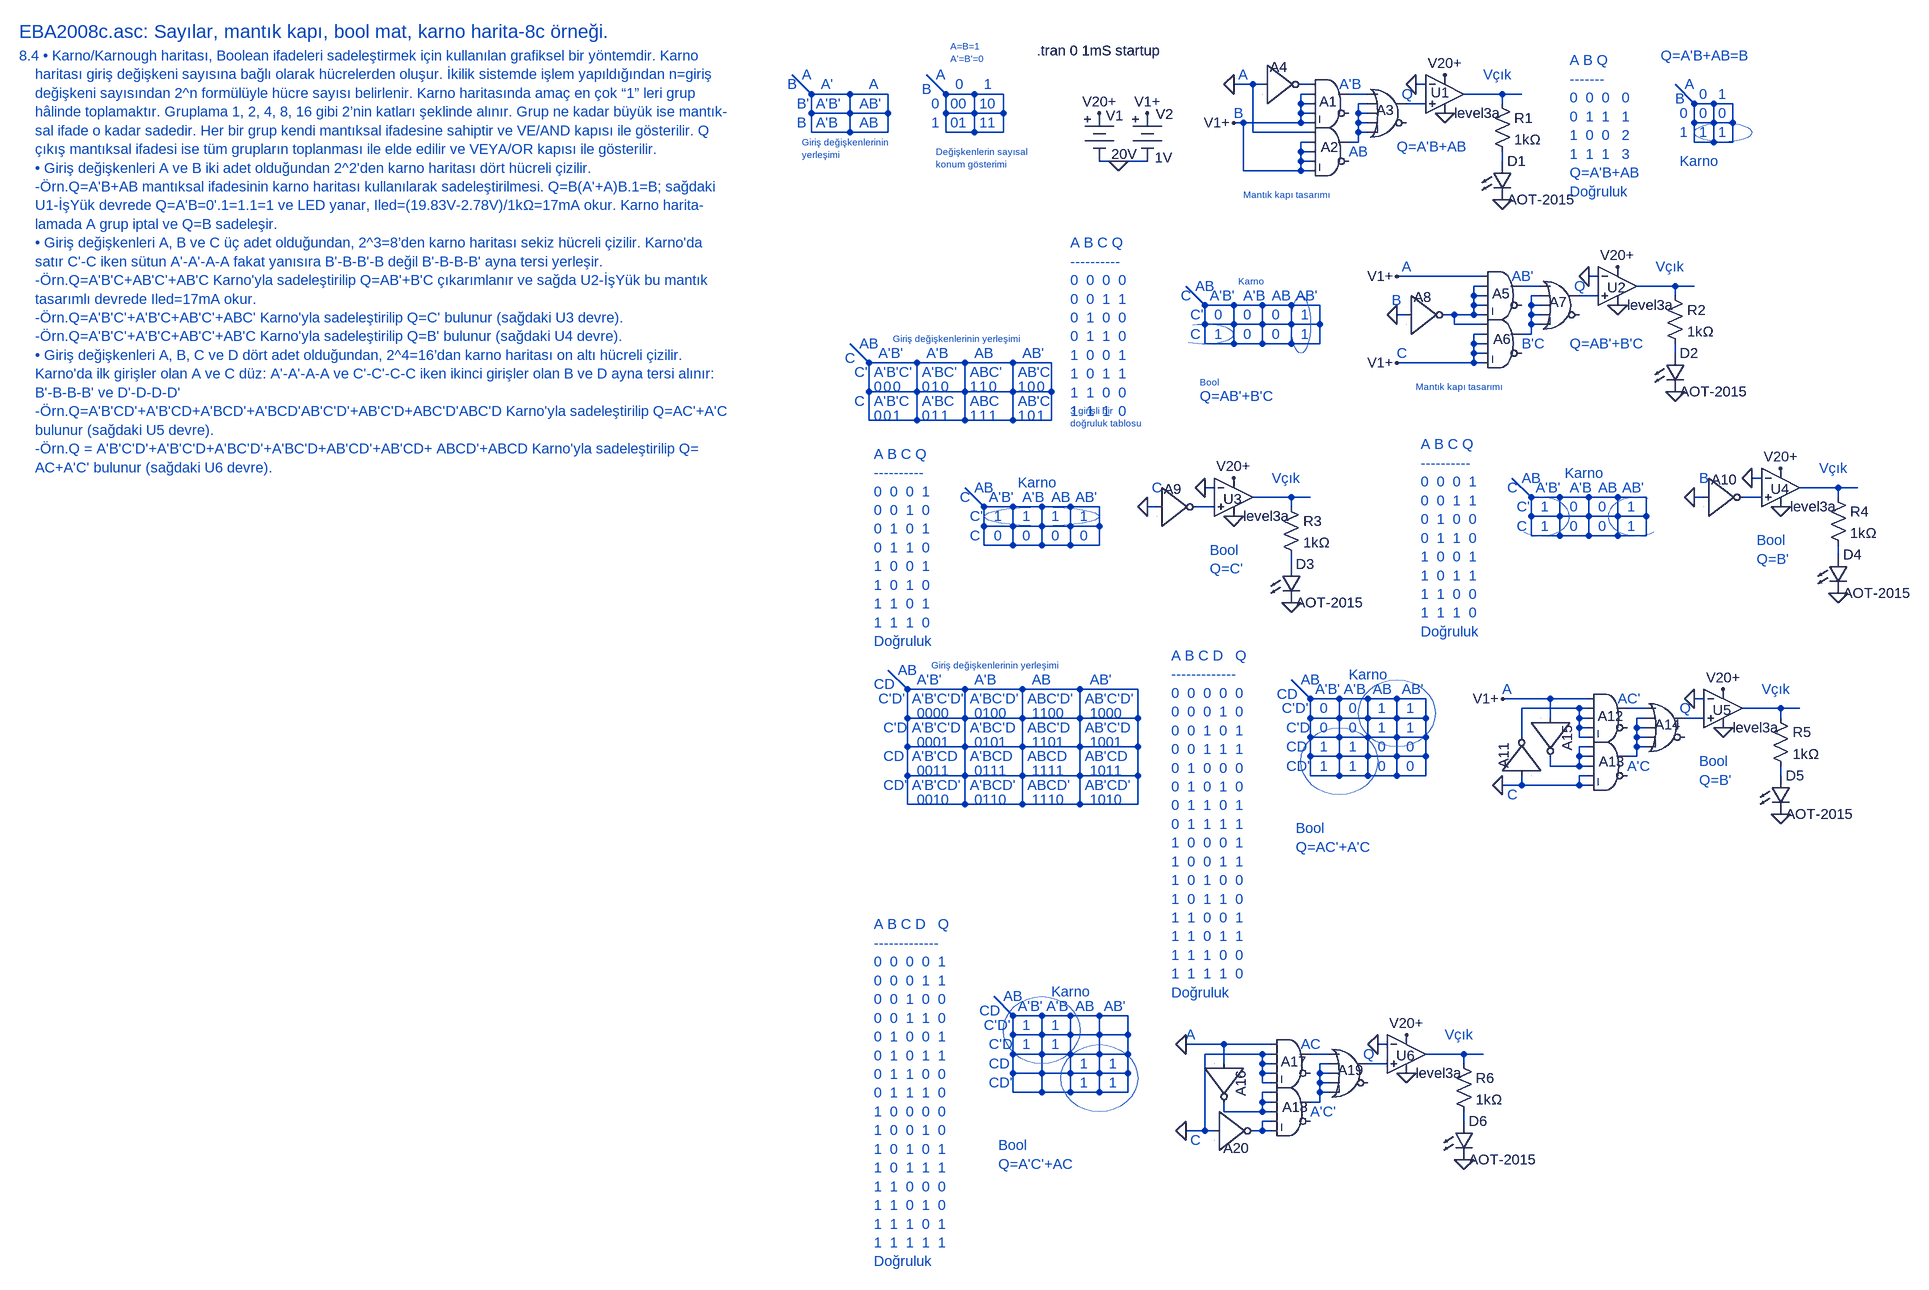
[diagram p0: schematic EBA2008c.asc]
EBA2008c.asc, the LTspice schematic file:
Version 4
SHEET 1 7064 4332
WIRE 1968 144 1936 144
WIRE 1984 144 1968 144
WIRE 2064 144 2048 144
WIRE 2256 144 2240 144
WIRE 1232 160 1200 128
WIRE 1296 160 1232 160
WIRE 1360 160 1296 160
WIRE 1456 160 1424 128
WIRE 1504 160 1456 160
WIRE 1552 160 1504 160
WIRE 2064 160 2048 160
WIRE 2160 160 2128 160
WIRE 2384 160 2320 160
WIRE 2416 160 2384 160
WIRE 2048 176 2048 160
WIRE 2064 176 2048 176
WIRE 2160 176 2144 176
WIRE 2256 176 2224 176
WIRE 2384 176 2384 160
WIRE 2704 176 2672 144
WIRE 2736 176 2704 176
WIRE 2768 176 2736 176
WIRE 1232 192 1232 160
WIRE 1296 192 1296 160
WIRE 1296 192 1232 192
WIRE 1360 192 1360 160
WIRE 1360 192 1296 192
WIRE 1456 192 1456 160
WIRE 1504 192 1504 160
WIRE 1504 192 1456 192
WIRE 1552 192 1552 160
WIRE 1552 192 1504 192
WIRE 2048 192 2048 176
WIRE 2064 192 2048 192
WIRE 2144 192 2144 176
WIRE 2160 192 2144 192
WIRE 1952 208 1936 208
WIRE 2048 208 2048 192
WIRE 2048 208 1952 208
WIRE 2064 208 2048 208
WIRE 2144 208 2144 192
WIRE 2160 208 2144 208
WIRE 2704 208 2704 176
WIRE 2736 208 2736 176
WIRE 2736 208 2704 208
WIRE 2768 208 2768 176
WIRE 2768 208 2736 208
WIRE 1232 224 1232 192
WIRE 1296 224 1296 192
WIRE 1296 224 1232 224
WIRE 1360 224 1360 192
WIRE 1360 224 1296 224
WIRE 1456 224 1456 192
WIRE 1504 224 1504 192
WIRE 1504 224 1456 224
WIRE 1552 224 1552 192
WIRE 1552 224 1504 224
WIRE 1968 224 1968 144
WIRE 2064 224 1968 224
WIRE 2144 224 2144 208
WIRE 2160 224 2144 224
WIRE 2064 240 2048 240
WIRE 2144 240 2144 224
WIRE 2144 240 2128 240
WIRE 2704 240 2704 208
WIRE 2736 240 2736 208
WIRE 2736 240 2704 240
WIRE 2768 240 2768 208
WIRE 2768 240 2736 240
WIRE 2048 256 2048 240
WIRE 2064 256 2048 256
WIRE 1744 272 1712 272
WIRE 1792 272 1744 272
WIRE 2048 272 2048 256
WIRE 2064 272 2048 272
WIRE 2384 272 2384 256
WIRE 1952 288 1952 208
WIRE 2048 288 2048 272
WIRE 2048 288 1952 288
WIRE 2064 288 2048 288
WIRE 2352 464 2208 464
WIRE 2544 464 2528 464
WIRE 2352 480 2336 480
WIRE 2448 480 2416 480
WIRE 2672 480 2608 480
WIRE 2704 480 2672 480
WIRE 2336 496 2336 480
WIRE 2352 496 2336 496
WIRE 2448 496 2432 496
WIRE 2544 496 2512 496
WIRE 2672 496 2672 480
WIRE 1888 512 1856 480
WIRE 1936 512 1888 512
WIRE 1984 512 1936 512
WIRE 2032 512 1984 512
WIRE 2080 512 2032 512
WIRE 2336 512 2336 496
WIRE 2352 512 2336 512
WIRE 2432 512 2432 496
WIRE 2448 512 2432 512
WIRE 2224 528 2208 528
WIRE 2304 528 2288 528
WIRE 2336 528 2336 512
WIRE 2336 528 2304 528
WIRE 2352 528 2336 528
WIRE 2432 528 2432 512
WIRE 2448 528 2432 528
WIRE 1888 544 1888 512
WIRE 1936 544 1936 512
WIRE 1936 544 1888 544
WIRE 1984 544 1984 512
WIRE 1984 544 1936 544
WIRE 2032 544 2032 512
WIRE 2032 544 1984 544
WIRE 2080 544 2080 512
WIRE 2080 544 2032 544
WIRE 2304 544 2304 528
WIRE 2352 544 2304 544
WIRE 2432 544 2432 528
WIRE 2448 544 2432 544
WIRE 2352 560 2336 560
WIRE 2432 560 2432 544
WIRE 2432 560 2416 560
WIRE 1888 576 1888 544
WIRE 1936 576 1936 544
WIRE 1936 576 1888 576
WIRE 1984 576 1984 544
WIRE 1984 576 1936 576
WIRE 2032 576 2032 544
WIRE 2032 576 1984 576
WIRE 2080 576 2080 544
WIRE 2080 576 2032 576
WIRE 2336 576 2336 560
WIRE 2352 576 2336 576
WIRE 2336 592 2336 576
WIRE 2352 592 2336 592
WIRE 2672 592 2672 576
WIRE 1328 608 1296 576
WIRE 1408 608 1328 608
WIRE 1488 608 1408 608
WIRE 1568 608 1488 608
WIRE 1632 608 1568 608
WIRE 2336 608 2336 592
WIRE 2336 608 2208 608
WIRE 2352 608 2336 608
WIRE 1328 656 1328 608
WIRE 1408 656 1408 608
WIRE 1408 656 1328 656
WIRE 1488 656 1488 608
WIRE 1488 656 1408 656
WIRE 1568 656 1568 608
WIRE 1568 656 1488 656
WIRE 1632 656 1632 608
WIRE 1632 656 1568 656
WIRE 1328 704 1328 656
WIRE 1408 704 1408 656
WIRE 1408 704 1328 704
WIRE 1488 704 1488 656
WIRE 1488 704 1408 704
WIRE 1568 704 1568 656
WIRE 1568 704 1488 704
WIRE 1632 704 1632 656
WIRE 1632 704 1568 704
WIRE 2816 800 2800 800
WIRE 1904 816 1888 816
WIRE 2944 816 2880 816
WIRE 2976 816 2944 816
WIRE 2032 832 1968 832
WIRE 2064 832 2032 832
WIRE 2432 832 2400 800
WIRE 2480 832 2432 832
WIRE 2528 832 2480 832
WIRE 2576 832 2528 832
WIRE 2624 832 2576 832
WIRE 2720 832 2704 832
WIRE 2816 832 2784 832
WIRE 2944 832 2944 816
WIRE 1520 848 1488 816
WIRE 1568 848 1520 848
WIRE 1616 848 1568 848
WIRE 1664 848 1616 848
WIRE 1712 848 1664 848
WIRE 1808 848 1792 848
WIRE 1904 848 1872 848
WIRE 2032 848 2032 832
WIRE 2432 864 2432 832
WIRE 2480 864 2480 832
WIRE 2480 864 2432 864
WIRE 2528 864 2528 832
WIRE 2528 864 2480 864
WIRE 2576 864 2576 832
WIRE 2576 864 2528 864
WIRE 2624 864 2624 832
WIRE 2624 864 2576 864
WIRE 1520 880 1520 848
WIRE 1568 880 1568 848
WIRE 1568 880 1520 880
WIRE 1616 880 1616 848
WIRE 1616 880 1568 880
WIRE 1664 880 1664 848
WIRE 1664 880 1616 880
WIRE 1712 880 1712 848
WIRE 1712 880 1664 880
WIRE 2432 896 2432 864
WIRE 2480 896 2480 864
WIRE 2480 896 2432 896
WIRE 2528 896 2528 864
WIRE 2528 896 2480 896
WIRE 2576 896 2576 864
WIRE 2576 896 2528 896
WIRE 2624 896 2624 864
WIRE 2624 896 2576 896
WIRE 1520 912 1520 880
WIRE 1568 912 1568 880
WIRE 1568 912 1520 912
WIRE 1616 912 1616 880
WIRE 1616 912 1568 912
WIRE 1664 912 1664 880
WIRE 1664 912 1616 912
WIRE 1712 912 1712 880
WIRE 1712 912 1664 912
WIRE 2944 928 2944 912
WIRE 2032 944 2032 928
WIRE 1392 1152 1360 1120
WIRE 1488 1152 1392 1152
WIRE 1584 1152 1488 1152
WIRE 1680 1152 1584 1152
WIRE 1776 1152 1680 1152
WIRE 2064 1168 2032 1136
WIRE 2112 1168 2064 1168
WIRE 2160 1168 2112 1168
WIRE 2208 1168 2160 1168
WIRE 2256 1168 2208 1168
WIRE 2464 1168 2384 1168
WIRE 2528 1168 2464 1168
WIRE 2720 1168 2704 1168
WIRE 2512 1184 2416 1184
WIRE 2528 1184 2512 1184
WIRE 2624 1184 2592 1184
WIRE 2848 1184 2784 1184
WIRE 2880 1184 2848 1184
WIRE 1392 1200 1392 1152
WIRE 1488 1200 1488 1152
WIRE 1488 1200 1392 1200
WIRE 1584 1200 1584 1152
WIRE 1584 1200 1488 1200
WIRE 1680 1200 1680 1152
WIRE 1680 1200 1584 1200
WIRE 1776 1200 1776 1152
WIRE 1776 1200 1680 1200
WIRE 2064 1200 2064 1168
WIRE 2112 1200 2112 1168
WIRE 2112 1200 2064 1200
WIRE 2160 1200 2160 1168
WIRE 2160 1200 2112 1200
WIRE 2208 1200 2208 1168
WIRE 2208 1200 2160 1200
WIRE 2256 1200 2256 1168
WIRE 2256 1200 2208 1200
WIRE 2464 1200 2464 1168
WIRE 2512 1200 2512 1184
WIRE 2528 1200 2512 1200
WIRE 2624 1200 2608 1200
WIRE 2720 1200 2688 1200
WIRE 2848 1200 2848 1184
WIRE 2512 1216 2512 1200
WIRE 2528 1216 2512 1216
WIRE 2608 1216 2608 1200
WIRE 2624 1216 2608 1216
WIRE 2064 1232 2064 1200
WIRE 2112 1232 2112 1200
WIRE 2112 1232 2064 1232
WIRE 2160 1232 2160 1200
WIRE 2160 1232 2112 1232
WIRE 2208 1232 2208 1200
WIRE 2208 1232 2160 1232
WIRE 2256 1232 2256 1200
WIRE 2256 1232 2208 1232
WIRE 2416 1232 2416 1184
WIRE 2512 1232 2512 1216
WIRE 2528 1232 2512 1232
WIRE 2608 1232 2608 1216
WIRE 2624 1232 2608 1232
WIRE 1392 1248 1392 1200
WIRE 1488 1248 1488 1200
WIRE 1488 1248 1392 1248
WIRE 1584 1248 1584 1200
WIRE 1584 1248 1488 1248
WIRE 1680 1248 1680 1200
WIRE 1680 1248 1584 1248
WIRE 1776 1248 1776 1200
WIRE 1776 1248 1680 1248
WIRE 2528 1248 2512 1248
WIRE 2608 1248 2608 1232
WIRE 2624 1248 2608 1248
WIRE 2064 1264 2064 1232
WIRE 2112 1264 2112 1232
WIRE 2112 1264 2064 1264
WIRE 2160 1264 2160 1232
WIRE 2160 1264 2112 1264
WIRE 2208 1264 2208 1232
WIRE 2208 1264 2160 1264
WIRE 2256 1264 2256 1232
WIRE 2256 1264 2208 1264
WIRE 2512 1264 2512 1248
WIRE 2528 1264 2512 1264
WIRE 2608 1264 2608 1248
WIRE 2608 1264 2592 1264
WIRE 2464 1280 2464 1264
WIRE 2512 1280 2512 1264
WIRE 2512 1280 2464 1280
WIRE 2528 1280 2512 1280
WIRE 1392 1296 1392 1248
WIRE 1488 1296 1488 1248
WIRE 1488 1296 1392 1296
WIRE 1584 1296 1584 1248
WIRE 1584 1296 1488 1296
WIRE 1680 1296 1680 1248
WIRE 1680 1296 1584 1296
WIRE 1776 1296 1776 1248
WIRE 1776 1296 1680 1296
WIRE 2064 1296 2064 1264
WIRE 2112 1296 2112 1264
WIRE 2112 1296 2064 1296
WIRE 2160 1296 2160 1264
WIRE 2160 1296 2112 1296
WIRE 2208 1296 2208 1264
WIRE 2208 1296 2160 1296
WIRE 2256 1296 2256 1264
WIRE 2256 1296 2208 1296
WIRE 2528 1296 2512 1296
WIRE 2848 1296 2848 1280
WIRE 2416 1312 2416 1296
WIRE 2416 1312 2384 1312
WIRE 2512 1312 2512 1296
WIRE 2512 1312 2416 1312
WIRE 2528 1312 2512 1312
WIRE 1392 1344 1392 1296
WIRE 1488 1344 1488 1296
WIRE 1488 1344 1392 1344
WIRE 1584 1344 1584 1296
WIRE 1584 1344 1488 1344
WIRE 1680 1344 1680 1296
WIRE 1680 1344 1584 1344
WIRE 1776 1344 1776 1296
WIRE 1776 1344 1680 1344
WIRE 1568 1696 1536 1664
WIRE 1616 1696 1568 1696
WIRE 1664 1696 1616 1696
WIRE 1712 1696 1664 1696
WIRE 1760 1696 1712 1696
WIRE 1568 1728 1568 1696
WIRE 1616 1728 1616 1696
WIRE 1616 1728 1568 1728
WIRE 1664 1728 1664 1696
WIRE 1664 1728 1616 1728
WIRE 1712 1728 1712 1696
WIRE 1712 1728 1664 1728
WIRE 1760 1728 1760 1696
WIRE 1760 1728 1712 1728
WIRE 1920 1744 1856 1744
WIRE 2000 1744 1920 1744
WIRE 2192 1744 2176 1744
WIRE 1568 1760 1568 1728
WIRE 1616 1760 1616 1728
WIRE 1616 1760 1568 1760
WIRE 1664 1760 1664 1728
WIRE 1664 1760 1616 1760
WIRE 1712 1760 1712 1728
WIRE 1712 1760 1664 1760
WIRE 1760 1760 1760 1728
WIRE 1760 1760 1712 1760
WIRE 1984 1760 1888 1760
WIRE 2000 1760 1984 1760
WIRE 2096 1760 2064 1760
WIRE 2320 1760 2256 1760
WIRE 2352 1760 2320 1760
WIRE 1920 1776 1920 1744
WIRE 1984 1776 1984 1760
WIRE 2000 1776 1984 1776
WIRE 2096 1776 2080 1776
WIRE 2192 1776 2160 1776
WIRE 2320 1776 2320 1760
WIRE 1568 1792 1568 1760
WIRE 1616 1792 1616 1760
WIRE 1616 1792 1568 1792
WIRE 1664 1792 1664 1760
WIRE 1664 1792 1616 1792
WIRE 1712 1792 1712 1760
WIRE 1712 1792 1664 1792
WIRE 1760 1792 1760 1760
WIRE 1760 1792 1712 1792
WIRE 1984 1792 1984 1776
WIRE 2000 1792 1984 1792
WIRE 2080 1792 2080 1776
WIRE 2096 1792 2080 1792
WIRE 1984 1808 1984 1792
WIRE 2000 1808 1984 1808
WIRE 2080 1808 2080 1792
WIRE 2096 1808 2080 1808
WIRE 1568 1824 1568 1792
WIRE 1616 1824 1616 1792
WIRE 1616 1824 1568 1824
WIRE 1664 1824 1664 1792
WIRE 1664 1824 1616 1824
WIRE 1712 1824 1712 1792
WIRE 1712 1824 1664 1824
WIRE 1760 1824 1760 1792
WIRE 1760 1824 1712 1824
WIRE 2000 1824 1984 1824
WIRE 2080 1824 2080 1808
WIRE 2096 1824 2080 1824
WIRE 1984 1840 1984 1824
WIRE 2000 1840 1984 1840
WIRE 2080 1840 2080 1824
WIRE 2080 1840 2064 1840
WIRE 1920 1856 1920 1840
WIRE 1984 1856 1984 1840
WIRE 1984 1856 1920 1856
WIRE 2000 1856 1984 1856
WIRE 2000 1872 1984 1872
WIRE 2320 1872 2320 1856
WIRE 1888 1888 1888 1760
WIRE 1888 1888 1856 1888
WIRE 1904 1888 1888 1888
WIRE 1984 1888 1984 1872
WIRE 1984 1888 1968 1888
WIRE 2000 1888 1984 1888
FLAG 1936 208 V1+
FLAG 2240 144 0
FLAG 2288 128 V20+
FLAG 2288 192 0
FLAG 1744 272 0
FLAG 1712 192 V20+
FLAG 1792 192 V1+
FLAG 2384 336 0
FLAG 1936 144 0
FLAG 2208 464 V1+
FLAG 2528 464 0
FLAG 2576 448 V20+
FLAG 2576 512 0
FLAG 2672 656 0
FLAG 2208 528 0
FLAG 2208 608 V1+
FLAG 1888 816 0
FLAG 1936 800 V20+
FLAG 1936 864 0
FLAG 2032 1008 0
FLAG 1792 848 0
FLAG 2800 800 0
FLAG 2848 784 V20+
FLAG 2848 848 0
FLAG 2944 992 0
FLAG 2704 832 0
FLAG 2704 1168 0
FLAG 2752 1152 V20+
FLAG 2752 1216 0
FLAG 2848 1360 0
FLAG 2384 1168 V1+
FLAG 2384 1312 0
FLAG 2176 1744 0
FLAG 2224 1728 V20+
FLAG 2224 1792 0
FLAG 2320 1936 0
FLAG 1856 1888 0
FLAG 1856 1744 0
SYMBOL Digital\\and 2096 112 R0
WINDOW 0 -17 61 Left 2
SYMATTR InstName A1
SYMBOL Digital\\and 2096 192 R0
WINDOW 0 -15 57 Left 2
SYMATTR InstName A2
SYMBOL Digital\\or 2192 128 R0
WINDOW 0 -18 59 Left 2
SYMATTR InstName A3
SYMBOL Digital\\inv 1984 80 R0
WINDOW 0 12 35 Left 2
SYMATTR InstName A4
SYMBOL OpAmps\\UniversalOpAmp3 2288 160 R0
WINDOW 0 -23 -2 Left 2
SYMATTR InstName U1
SYMBOL Misc\\battery 1712 176 R0
WINDOW 0 11 20 Left 2
WINDOW 3 20 84 Left 2
SYMATTR InstName V1
SYMATTR Value 20V
SYMBOL Misc\\battery 1792 176 R0
WINDOW 0 14 18 Left 2
WINDOW 3 13 90 Left 2
SYMATTR InstName V2
SYMATTR Value 1V
SYMBOL LED 2368 272 R0
SYMATTR InstName D1
SYMATTR Value AOT-2015
SYMATTR Description Diode
SYMATTR Type diode
SYMBOL res 2368 160 R0
SYMATTR InstName R1
SYMATTR Value 1kΩ
SYMBOL Digital\\and 2384 432 R0
WINDOW 0 -17 61 Left 2
SYMATTR InstName A5
SYMBOL Digital\\and 2384 512 R0
WINDOW 0 -15 57 Left 2
SYMATTR InstName A6
SYMBOL Digital\\or 2480 448 R0
WINDOW 0 -18 59 Left 2
SYMATTR InstName A7
SYMBOL Digital\\inv 2224 464 R0
WINDOW 0 12 35 Left 2
SYMATTR InstName A8
SYMBOL OpAmps\\UniversalOpAmp3 2576 480 R0
WINDOW 0 -17 3 Left 2
SYMATTR InstName U2
SYMBOL LED 2656 592 R0
SYMATTR InstName D2
SYMATTR Value AOT-2015
SYMATTR Description Diode
SYMATTR Type diode
SYMBOL res 2656 480 R0
SYMATTR InstName R2
SYMATTR Value 1kΩ
SYMBOL OpAmps\\UniversalOpAmp3 1936 832 R0
WINDOW 0 -17 3 Left 2
SYMATTR InstName U3
SYMBOL LED 2016 944 R0
SYMATTR InstName D3
SYMATTR Value AOT-2015
SYMATTR Description Diode
SYMATTR Type diode
SYMBOL res 2016 832 R0
SYMATTR InstName R3
SYMATTR Value 1kΩ
SYMBOL Digital\\inv 1808 784 R0
WINDOW 0 12 35 Left 2
SYMATTR InstName A9
SYMBOL OpAmps\\UniversalOpAmp3 2848 816 R0
WINDOW 0 -17 3 Left 2
SYMATTR InstName U4
SYMBOL LED 2928 928 R0
SYMATTR InstName D4
SYMATTR Value AOT-2015
SYMATTR Description Diode
SYMATTR Type diode
SYMBOL res 2928 816 R0
SYMATTR InstName R4
SYMATTR Value 1kΩ
SYMBOL Digital\\inv 2720 768 R0
WINDOW 0 12 35 Left 2
SYMATTR InstName A10
SYMBOL OpAmps\\UniversalOpAmp3 2752 1184 R0
WINDOW 0 -17 3 Left 2
SYMATTR InstName U5
SYMBOL LED 2832 1296 R0
SYMATTR InstName D5
SYMATTR Value AOT-2015
SYMATTR Description Diode
SYMATTR Type diode
SYMBOL res 2832 1184 R0
SYMATTR InstName R5
SYMATTR Value 1kΩ
SYMBOL Digital\\inv 2352 1296 R270
WINDOW 0 12 35 Left 2
SYMATTR InstName A11
SYMBOL Digital\\and 2560 1136 R0
WINDOW 0 -17 61 Left 2
SYMATTR InstName A12
SYMBOL Digital\\and 2560 1216 R0
WINDOW 0 -15 57 Left 2
SYMATTR InstName A13
SYMBOL Digital\\or 2656 1152 R0
WINDOW 0 -18 59 Left 2
SYMATTR InstName A14
SYMBOL Digital\\inv 2528 1200 R90
WINDOW 0 12 35 Left 2
SYMATTR InstName A15
SYMBOL OpAmps\\UniversalOpAmp3 2224 1760 R0
WINDOW 0 -17 3 Left 2
SYMATTR InstName U6
SYMBOL LED 2304 1872 R0
SYMATTR InstName D6
SYMATTR Value AOT-2015
SYMATTR Description Diode
SYMATTR Type diode
SYMBOL res 2304 1760 R0
SYMATTR InstName R6
SYMATTR Value 1kΩ
SYMBOL Digital\\inv 1984 1776 R90
WINDOW 0 12 35 Left 2
SYMATTR InstName A16
SYMBOL Digital\\and 2032 1712 R0
WINDOW 0 -17 61 Left 2
SYMATTR InstName A17
SYMBOL Digital\\and 2032 1792 R0
WINDOW 0 -15 57 Left 2
SYMATTR InstName A18
SYMBOL Digital\\or 2128 1728 R0
WINDOW 0 -18 59 Left 2
SYMATTR InstName A19
SYMBOL Digital\\inv 1904 1824 R0
WINDOW 0 15 93 Left 2
SYMATTR InstName A20
TEXT -232 56 Left 3 ;EBA2008c.asc: Sayılar, mantık kapı, bool mat, karno harita-8c örneği.
TEXT -232 96 Left 2 ;8.4 • Karno/Karnough haritası, Boolean ifadeleri sadeleştirmek için kullanılan grafiksel bir yöntemdir. Karno \n    haritası giriş değişkeni sayısına bağlı olarak hücrelerden oluşur. İkilik sistemde işlem yapıldığından n=giriş \n    değişkeni sayısından 2^n formülüyle hücre sayısı belirlenir. Karno haritasında amaç en çok “1” leri grup\n    hâlinde toplamaktır. Gruplama 1, 2, 4, 8, 16 gibi 2’nin katları şeklinde alınır. Grup ne kadar büyük ise mantık-\n    sal ifade o kadar sadedir. Her bir grup kendi mantıksal ifadesine sahiptir ve VE/AND kapısı ile gösterilir. Q \n    çıkış mantıksal ifadesi ise tüm grupların toplanması ile elde edilir ve VEYA/OR kapısı ile gösterilir.\n    • Giriş değişkenleri A ve B iki adet olduğundan 2^2'den karno haritası dört hücreli çizilir.\n    -Örn.Q=A'B+AB mantıksal ifadesinin karno haritası kullanılarak sadeleştirilmesi. Q=B(A'+A)B.1=B; sağdaki \n    U1-İşYük devrede Q=A'B=0'.1=1.1=1 ve LED yanar, Iled=(19.83V-2.78V)/1kΩ=17mA okur. Karno harita-\n    lamada A grup iptal ve Q=B sadeleşir.\n    • Giriş değişkenleri A, B ve C üç adet olduğundan, 2^3=8’den karno haritası sekiz hücreli çizilir. Karno'da\n    satır C'-C iken sütun A'-A'-A-A fakat yanısıra B'-B-B'-B değil B'-B-B-B' ayna tersi yerleşir.\n    -Örn.Q=A'B'C+AB'C'+AB'C Karno'yla sadeleştirilip Q=AB'+B'C çıkarımlanır ve sağda U2-İşYük bu mantık\n    tasarımlı devrede Iled=17mA okur.\n    -Örn.Q=A'B'C'+A'B'C+AB'C'+ABC' Karno'yla sadeleştirilip Q=C' bulunur (sağdaki U3 devre).\n    -Örn.Q=A'B'C'+A'B'C+AB'C'+AB'C Karno'yla sadeleştirilip Q=B' bulunur (sağdaki U4 devre).\n    • Giriş değişkenleri A, B, C ve D dört adet olduğundan, 2^4=16’dan karno haritası on altı hücreli çizilir.\n    Karno'da ilk girişler olan A ve C düz: A'-A'-A-A ve C'-C'-C-C iken ikinci girişler olan B ve D ayna tersi alınır:\n    B'-B-B-B' ve D'-D-D-D'\n    -Örn.Q=A'B'CD'+A'B'CD+A'BCD'+A'BCD'AB'C'D'+AB'C'D+ABC'D'ABC'D Karno'yla sadeleştirilip Q=AC'+A'C\n    bulunur (sağdaki U5 devre).\n    -Örn.Q = A'B'C'D'+A'B'C'D+A'BC'D'+A'BC'D+AB'CD'+AB'CD+ ABCD'+ABCD Karno'yla sadeleştirilip Q=\n    AC+A'C' bulunur (sağdaki U6 devre).
TEXT 1432 176 Left 2 ;0
TEXT 1432 208 Left 2 ;1
TEXT 1472 144 Left 2 ;0
TEXT 1520 144 Left 2 ;1
TEXT 1440 128 Left 2 ;A
TEXT 1416 152 Left 2 ;B
TEXT 1464 176 Left 2 ;00
TEXT 1512 176 Left 2 ;10
TEXT 1464 208 Left 2 ;01
TEXT 1512 208 Left 2 ;11
TEXT 1208 176 Left 2 ;B'
TEXT 1208 208 Left 2 ;B
TEXT 1248 144 Left 2 ;A'
TEXT 1328 144 Left 2 ;A
TEXT 1216 128 Left 2 ;A
TEXT 1192 144 Left 2 ;B
TEXT 1240 176 Left 2 ;A'B'
TEXT 1312 176 Left 2 ;AB'
TEXT 1240 208 Left 2 ;A'B
TEXT 1312 208 Left 2 ;AB
TEXT 1464 80 Left 1 ;A=B=1\nA'=B'=0
TEXT 1216 240 Left 1 ;Giriş değişkenlerinin\nyerleşimi
TEXT 1440 256 Left 1 ;Değişkenlerin sayısal \nkonum gösterimi
TEXT 2496 104 Left 2 ;A B Q\n-------\n0  0  0   0\n0  1  1   1\n1  0  0   2\n1  1  1   3\nQ=A'B+AB\nDoğruluk
TEXT 2680 192 Left 2 ;0
TEXT 2680 224 Left 2 ;1
TEXT 2712 160 Left 2 ;0
TEXT 2744 160 Left 2 ;1
TEXT 2672 168 Left 2 ;B
TEXT 2712 192 Left 2 ;0
TEXT 2712 224 Left 2 ;1
TEXT 2688 144 Left 2 ;A
TEXT 2680 272 Left 2 ;Karno
TEXT 1944 128 Left 2 ;A
TEXT 1936 192 Left 2 ;B
TEXT 2216 160 Left 2 ;Q
TEXT 2208 248 Left 2 ;Q=A'B+AB
TEXT 1952 328 Left 1 ;Mantık kapı tasarımı
TEXT 1608 88 Left 2 !.tran 0 1mS startup
TEXT 2112 144 Left 2 ;A'B
TEXT 2128 256 Left 2 ;AB
TEXT 2352 128 Left 2 ;Vçık
TEXT 2648 96 Left 2 ;Q=A'B+AB=B
TEXT 2744 224 Left 2 ;1
TEXT 2744 192 Left 2 ;0
TEXT 1304 624 Left 2 ;C'
TEXT 1304 672 Left 2 ;C
TEXT 1344 592 Left 2 ;A'B'
TEXT 1424 592 Left 2 ;A'B
TEXT 1312 576 Left 2 ;AB
TEXT 1288 600 Left 2 ;C
TEXT 1336 624 Left 2 ;A'B'C'
TEXT 1336 672 Left 2 ;A'B'C
TEXT 1416 624 Left 2 ;A'BC'
TEXT 1416 672 Left 2 ;A'BC
TEXT 1368 568 Left 1 ;Giriş değişkenlerinin yerleşimi
TEXT 1504 592 Left 2 ;AB
TEXT 1584 592 Left 2 ;AB'
TEXT 1496 624 Left 2 ;ABC'
TEXT 1496 672 Left 2 ;ABC
TEXT 1576 624 Left 2 ;AB'C'
TEXT 1576 672 Left 2 ;AB'C
TEXT 1664 408 Left 2 ;A B C Q\n----------\n0  0  0  0\n0  0  1  1\n0  1  0  0\n0  1  1  0\n1  0  0  1\n1  0  1  1\n1  1  0  0\n1  1  1  0
TEXT 1664 688 Left 1 ;3 girişli bir\ndoğruluk tablosu
TEXT 1944 472 Left 1 ;Karno
TEXT 1880 664 Left 2 ;Q=AB'+B'C
TEXT 1864 528 Left 2 ;C'
TEXT 1864 560 Left 2 ;C
TEXT 1896 496 Left 2 ;A'B'
TEXT 1952 496 Left 2 ;A'B
TEXT 1872 480 Left 2 ;AB
TEXT 2208 592 Left 2 ;C
TEXT 2000 496 Left 2 ;AB
TEXT 1880 640 Left 1 ;Bool
TEXT 1904 528 Left 2 ;0
TEXT 1336 648 Left 2 ;0
TEXT 1352 648 Left 2 ;0
TEXT 1368 648 Left 2 ;0
TEXT 1336 696 Left 2 ;0
TEXT 1352 696 Left 2 ;0
TEXT 1368 696 Left 2 ;1
TEXT 1416 648 Left 2 ;0
TEXT 1432 648 Left 2 ;1
TEXT 1448 648 Left 2 ;0
TEXT 1416 696 Left 2 ;0
TEXT 1432 696 Left 2 ;1
TEXT 1448 696 Left 2 ;1
TEXT 1496 648 Left 2 ;1
TEXT 1512 648 Left 2 ;1
TEXT 1528 648 Left 2 ;0
TEXT 1496 696 Left 2 ;1
TEXT 1512 696 Left 2 ;1
TEXT 1528 696 Left 2 ;1
TEXT 1576 648 Left 2 ;1
TEXT 1592 648 Left 2 ;0
TEXT 1608 648 Left 2 ;0
TEXT 1576 696 Left 2 ;1
TEXT 1592 696 Left 2 ;0
TEXT 1608 696 Left 2 ;1
TEXT 1904 560 Left 2 ;1
TEXT 1952 528 Left 2 ;0
TEXT 1952 560 Left 2 ;0
TEXT 2000 528 Left 2 ;0
TEXT 2000 560 Left 2 ;0
TEXT 2048 528 Left 2 ;1
TEXT 2048 560 Left 2 ;1
TEXT 2040 496 Left 2 ;AB'
TEXT 2216 448 Left 2 ;A
TEXT 2200 504 Left 2 ;B
TEXT 2504 480 Left 2 ;Q
TEXT 2240 648 Left 1 ;Mantık kapı tasarımı
TEXT 2400 464 Left 2 ;AB'
TEXT 2416 576 Left 2 ;B'C
TEXT 2640 448 Left 2 ;Vçık
TEXT 1848 496 Left 2 ;C
TEXT 2496 576 Left 2 ;Q=AB'+B'C
TEXT 1336 760 Left 2 ;A B C Q\n----------\n0  0  0  1\n0  0  1  0\n0  1  0  1\n0  1  1  0\n1  0  0  1\n1  0  1  0\n1  1  0  1\n1  1  1  0\nDoğruluk
TEXT 1576 808 Left 2 ;Karno
TEXT 1496 864 Left 2 ;C'
TEXT 1496 896 Left 2 ;C
TEXT 1528 832 Left 2 ;A'B'
TEXT 1584 832 Left 2 ;A'B
TEXT 1504 816 Left 2 ;AB
TEXT 1632 832 Left 2 ;AB
TEXT 1584 896 Left 2 ;0
TEXT 1632 896 Left 2 ;0
TEXT 1536 864 Left 2 ;1
TEXT 1680 864 Left 2 ;1
TEXT 1672 832 Left 2 ;AB'
TEXT 1480 832 Left 2 ;C
TEXT 1632 864 Left 2 ;1
TEXT 1536 896 Left 2 ;0
TEXT 1896 920 Left 2 ;Bool\nQ=C'
TEXT 1584 864 Left 2 ;1
TEXT 1680 896 Left 2 ;0
TEXT 2000 800 Left 2 ;Vçık
TEXT 1800 816 Left 2 ;C
TEXT 2248 744 Left 2 ;A B C Q\n----------\n0  0  0  1\n0  0  1  1\n0  1  0  0\n0  1  1  0\n1  0  0  1\n1  0  1  1\n1  1  0  0\n1  1  1  0\nDoğruluk
TEXT 2488 792 Left 2 ;Karno
TEXT 2408 848 Left 2 ;C'
TEXT 2408 880 Left 2 ;C
TEXT 2440 816 Left 2 ;A'B'
TEXT 2496 816 Left 2 ;A'B
TEXT 2416 800 Left 2 ;AB
TEXT 2544 816 Left 2 ;AB
TEXT 2496 880 Left 2 ;0
TEXT 2544 880 Left 2 ;0
TEXT 2448 848 Left 2 ;1
TEXT 2592 848 Left 2 ;1
TEXT 2584 816 Left 2 ;AB'
TEXT 2392 816 Left 2 ;C
TEXT 2592 880 Left 2 ;1
TEXT 2808 904 Left 2 ;Bool\nQ=B'
TEXT 2448 880 Left 2 ;1
TEXT 2544 848 Left 2 ;0
TEXT 2912 784 Left 2 ;Vçık
TEXT 2712 800 Left 2 ;B
TEXT 2496 848 Left 2 ;0
TEXT 1344 1168 Left 2 ;C'D'
TEXT 1352 1216 Left 2 ;C'D
TEXT 1408 1136 Left 2 ;A'B'
TEXT 1504 1136 Left 2 ;A'B
TEXT 1376 1120 Left 2 ;AB
TEXT 1336 1144 Left 2 ;CD
TEXT 1400 1168 Left 2 ;A'B'C'D'
TEXT 1400 1216 Left 2 ;A'B'C'D
TEXT 1496 1168 Left 2 ;A'BC'D'
TEXT 1496 1216 Left 2 ;A'BC'D
TEXT 1432 1112 Left 1 ;Giriş değişkenlerinin yerleşimi
TEXT 1600 1136 Left 2 ;AB
TEXT 1696 1136 Left 2 ;AB'
TEXT 1592 1168 Left 2 ;ABC'D'
TEXT 1592 1216 Left 2 ;ABC'D
TEXT 1688 1168 Left 2 ;AB'C'D'
TEXT 1688 1216 Left 2 ;AB'C'D
TEXT 1352 1264 Left 2 ;CD
TEXT 1352 1312 Left 2 ;CD'
TEXT 1400 1264 Left 2 ;A'B'CD
TEXT 1400 1312 Left 2 ;A'B'CD'
TEXT 1496 1264 Left 2 ;A'BCD
TEXT 1496 1312 Left 2 ;A'BCD'
TEXT 1592 1264 Left 2 ;ABCD
TEXT 1592 1312 Left 2 ;ABCD'
TEXT 1688 1264 Left 2 ;AB'CD
TEXT 1688 1312 Left 2 ;AB'CD'
TEXT 1408 1192 Left 2 ;0000
TEXT 1408 1240 Left 2 ;0001
TEXT 1504 1192 Left 2 ;0100
TEXT 1504 1240 Left 2 ;0101
TEXT 1600 1192 Left 2 ;1100
TEXT 1600 1240 Left 2 ;1101
TEXT 1696 1192 Left 2 ;1000
TEXT 1696 1240 Left 2 ;1001
TEXT 1408 1288 Left 2 ;0011
TEXT 1408 1336 Left 2 ;0010
TEXT 1504 1288 Left 2 ;0111
TEXT 1504 1336 Left 2 ;0110
TEXT 1600 1288 Left 2 ;1111
TEXT 1600 1336 Left 2 ;1110
TEXT 1696 1288 Left 2 ;1011
TEXT 1696 1336 Left 2 ;1010
TEXT 1832 1096 Left 2 ;A B C D   Q\n-------------\n0  0  0  0  0\n0  0  0  1  0\n0  0  1  0  1\n0  0  1  1  1\n0  1  0  0  0\n0  1  0  1  0\n0  1  1  0  1\n0  1  1  1  1\n1  0  0  0  1\n1  0  0  1  1\n1  0  1  0  0\n1  0  1  1  0\n1  1  0  0  1\n1  1  0  1  1\n1  1  1  0  0\n1  1  1  1  0\nDoğruluk
TEXT 2016 1184 Left 2 ;C'D'
TEXT 2024 1216 Left 2 ;C'D
TEXT 2072 1152 Left 2 ;A'B'
TEXT 2120 1152 Left 2 ;A'B
TEXT 2048 1136 Left 2 ;AB
TEXT 2008 1160 Left 2 ;CD
TEXT 2168 1152 Left 2 ;AB
TEXT 2216 1152 Left 2 ;AB'
TEXT 2024 1248 Left 2 ;CD
TEXT 2024 1280 Left 2 ;CD'
TEXT 2128 1128 Left 2 ;Karno
TEXT 2080 1184 Left 2 ;0
TEXT 2080 1216 Left 2 ;0
TEXT 2080 1280 Left 2 ;1
TEXT 2080 1248 Left 2 ;1
TEXT 2128 1184 Left 2 ;0
TEXT 2128 1216 Left 2 ;0
TEXT 2128 1280 Left 2 ;1
TEXT 2128 1248 Left 2 ;1
TEXT 2224 1184 Left 2 ;1
TEXT 2224 1216 Left 2 ;1
TEXT 2224 1280 Left 2 ;0
TEXT 2224 1248 Left 2 ;0
TEXT 2176 1184 Left 2 ;1
TEXT 2176 1216 Left 2 ;1
TEXT 2176 1280 Left 2 ;0
TEXT 2176 1248 Left 2 ;0
TEXT 2040 1384 Left 2 ;Bool\nQ=AC'+A'C
TEXT 2712 1272 Left 2 ;Bool\nQ=B'
TEXT 2816 1152 Left 2 ;Vçık
TEXT 2392 1328 Left 2 ;C
TEXT 2680 1184 Left 2 ;Q
TEXT 2576 1168 Left 2 ;AC'
TEXT 2592 1280 Left 2 ;A'C
TEXT 2384 1152 Left 2 ;A
TEXT 1336 1544 Left 2 ;A B C D   Q\n-------------\n0  0  0  0  1\n0  0  0  1  1\n0  0  1  0  0\n0  0  1  1  0\n0  1  0  0  1\n0  1  0  1  1\n0  1  1  0  0\n0  1  1  1  0\n1  0  0  0  0\n1  0  0  1  0\n1  0  1  0  1\n1  0  1  1  1\n1  1  0  0  0\n1  1  0  1  0\n1  1  1  0  1\n1  1  1  1  1\nDoğruluk
TEXT 1520 1712 Left 2 ;C'D'
TEXT 1528 1744 Left 2 ;C'D
TEXT 1576 1680 Left 2 ;A'B'
TEXT 1624 1680 Left 2 ;A'B
TEXT 1552 1664 Left 2 ;AB
TEXT 1512 1688 Left 2 ;CD
TEXT 1672 1680 Left 2 ;AB
TEXT 1720 1680 Left 2 ;AB'
TEXT 1528 1776 Left 2 ;CD
TEXT 1528 1808 Left 2 ;CD'
TEXT 1632 1656 Left 2 ;Karno
TEXT 1632 1744 Left 2 ;1
TEXT 1544 1912 Left 2 ;Bool\nQ=A'C'+AC
TEXT 2288 1728 Left 2 ;Vçık
TEXT 1864 1904 Left 2 ;C
TEXT 2152 1760 Left 2 ;Q
TEXT 2048 1744 Left 2 ;AC
TEXT 2064 1856 Left 2 ;A'C'
TEXT 1856 1728 Left 2 ;A
TEXT 1584 1712 Left 2 ;1
TEXT 1584 1744 Left 2 ;1
TEXT 1632 1712 Left 2 ;1
TEXT 1728 1808 Left 2 ;1
TEXT 1728 1776 Left 2 ;1
TEXT 1680 1808 Left 2 ;1
TEXT 1680 1776 Left 2 ;1
CIRCLE Normal 2704 240 2800 208 2
CIRCLE Normal 2032 496 2064 592 2
CIRCLE Normal 1712 848 1520 880 2
CIRCLE Normal 2176 1216 2048 1328 2
CIRCLE Normal 2272 1136 2144 1248 2
CIRCLE Normal 1776 1744 1648 1856 2
CIRCLE Normal 1680 1664 1552 1776 2
ARC Normal 2400 832 2496 896 2409 899 2430 835 2
ARC Normal 1840 544 1936 576 1849 579 1870 547 2
ARC Normal 2656 832 2560 896 2626 835 2647 899 2

The netlist it stands for:
* EBA2008c.asc
A1 N001 V1+ V1+ V1+ V1+ 0 N004 0 AND
A2 0 V1+ V1+ V1+ V1+ 0 N006 0 AND
A3 N004 N006 N006 N006 N006 0 N007 0 OR
A4 0 0 0 0 0 N001 0 0 BUF
XU1 N007 0 V20+ 0 N005 level3a  ; pins In+ In- V+ V- OUT
V1 V20+ 0 20V
V2 V1+ 0 1V
D1 N009 0 AOT-2015
R1 N005 N009 1kΩ
A5 V1+ N010 N010 N010 N010 0 N011 0 AND
A6 N010 V1+ V1+ V1+ V1+ 0 N013 0 AND
A7 N011 N013 N013 N013 N013 0 N014 0 OR
A8 0 0 0 0 0 N010 0 0 BUF
XU2 N014 0 V20+ 0 N012 level3a  ; pins In+ In- V+ V- OUT
D2 N016 0 AOT-2015
R2 N012 N016 1kΩ
XU3 N023 0 V20+ 0 N019 level3a  ; pins In+ In- V+ V- OUT
D3 N025 0 AOT-2015
R3 N019 N025 1kΩ
A9 0 0 0 0 0 N023 0 0 BUF
XU4 N021 0 V20+ 0 N018 level3a  ; pins In+ In- V+ V- OUT
D4 N024 0 AOT-2015
R4 N018 N024 1kΩ
A10 0 0 0 0 0 N021 0 0 BUF
XU5 N032 0 V20+ 0 N030 level3a  ; pins In+ In- V+ V- OUT
D5 N034 0 AOT-2015
R5 N030 N034 1kΩ
A11 0 0 0 0 0 N028 0 0 BUF
A12 V1+ N028 N028 N028 N028 0 N029 0 AND
A13 N033 N033 N033 0 0 0 N031 0 AND
A14 N029 N031 N031 N031 N031 0 N032 0 OR
A15 V1+ 0 0 0 0 N033 0 0 BUF
XU6 N039 0 V20+ 0 N037 level3a  ; pins In+ In- V+ V- OUT
D6 N042 0 AOT-2015
R6 N037 N042 1kΩ
A16 0 0 0 0 0 N040 0 0 BUF
A17 0 0 0 0 0 0 N036 0 AND
A18 N040 N040 N040 N041 N041 0 N038 0 AND
A19 N036 N038 N038 N038 N038 0 N039 0 OR
A20 0 0 0 0 0 N041 0 0 BUF
.model D D
.lib standard.dio
* EBA2008c.asc: Sayılar, mantık kapı, bool mat, karno harita-8c örneği.
* 8.4 • Karno/Karnough haritası, Boolean ifadeleri sadeleştirmek için kullanılan grafiksel bir yöntemdir. Karno
*     haritası giriş değişkeni sayısına bağlı olarak hücrelerden oluşur. İkilik sistemde işlem yapıldığından n=giriş
*     değişkeni sayısından 2^n formülüyle hücre sayısı belirlenir. Karno haritasında amaç en çok “1” leri grup
*     hâlinde toplamaktır. Gruplama 1, 2, 4, 8, 16 gibi 2’nin katları şeklinde alınır. Grup ne kadar büyük ise mantık-
*     sal ifade o kadar sadedir. Her bir grup kendi mantıksal ifadesine sahiptir ve VE/AND kapısı ile gösterilir. Q
*     çıkış mantıksal ifadesi ise tüm grupların toplanması ile elde edilir ve VEYA/OR kapısı ile gösterilir.
*     • Giriş değişkenleri A ve B iki adet olduğundan 2^2'den karno haritası dört hücreli çizilir.
*     -Örn.Q=A'B+AB mantıksal ifadesinin karno haritası kullanılarak sadeleştirilmesi. Q=B(A'+A)B.1=B; sağdaki
*     U1-İşYük devrede Q=A'B=0'.1=1.1=1 ve LED yanar, Iled=(19.83V-2.78V)/1kΩ=17mA okur. Karno harita-
*     lamada A grup iptal ve Q=B sadeleşir.
*     • Giriş değişkenleri A, B ve C üç adet olduğundan, 2^3=8’den karno haritası sekiz hücreli çizilir. Karno'da
*     satır C'-C iken sütun A'-A'-A-A fakat yanısıra B'-B-B'-B değil B'-B-B-B' ayna tersi yerleşir.
*     -Örn.Q=A'B'C+AB'C'+AB'C Karno'yla sadeleştirilip Q=AB'+B'C çıkarımlanır ve sağda U2-İşYük bu mantık
*     tasarımlı devrede Iled=17mA okur.
*     -Örn.Q=A'B'C'+A'B'C+AB'C'+ABC' Karno'yla sadeleştirilip Q=C' bulunur (sağdaki U3 devre).
*     -Örn.Q=A'B'C'+A'B'C+AB'C'+AB'C Karno'yla sadeleştirilip Q=B' bulunur (sağdaki U4 devre).
*     • Giriş değişkenleri A, B, C ve D dört adet olduğundan, 2^4=16’dan karno haritası on altı hücreli çizilir.
*     Karno'da ilk girişler olan A ve C düz: A'-A'-A-A ve C'-C'-C-C iken ikinci girişler olan B ve D ayna tersi alınır:
*     B'-B-B-B' ve D'-D-D-D'
*     -Örn.Q=A'B'CD'+A'B'CD+A'BCD'+A'BCD'AB'C'D'+AB'C'D+ABC'D'ABC'D Karno'yla sadeleştirilip Q=AC'+A'C
*     bulunur (sağdaki U5 devre).
*     -Örn.Q = A'B'C'D'+A'B'C'D+A'BC'D'+A'BC'D+AB'CD'+AB'CD+ ABCD'+ABCD Karno'yla sadeleştirilip Q=
*     AC+A'C' bulunur (sağdaki U6 devre).
* 0
* 1
* 0
* 1
* A
* B
* 00
* 10
* 01
* 11
* B'
* B
* A'
* A
* A
* B
* A'B'
* AB'
* A'B
* AB
* A=B=1
* A'=B'=0
* Giriş değişkenlerinin
* yerleşimi
* Değişkenlerin sayısal
* konum gösterimi
* A B Q
* -------
* 0  0  0   0
* 0  1  1   1
* 1  0  0   2
* 1  1  1   3
* Q=A'B+AB
* Doğruluk
* 0
* 1
* 0
* 1
* B
* 0
* 1
* A
* Karno
* A
* B
* Q
* Q=A'B+AB
* Mantık kapı tasarımı
.tran 0 1mS startup
* A'B
* AB
* Vçık
* Q=A'B+AB=B
* 1
* 0
* C'
* C
* A'B'
* A'B
* AB
* C
* A'B'C'
* A'B'C
* A'BC'
* A'BC
* Giriş değişkenlerinin yerleşimi
* AB
* AB'
* ABC'
* ABC
* AB'C'
* AB'C
* A B C Q
* ----------
* 0  0  0  0
* 0  0  1  1
* 0  1  0  0
* 0  1  1  0
* 1  0  0  1
* 1  0  1  1
* 1  1  0  0
* 1  1  1  0
* 3 girişli bir
* doğruluk tablosu
* Karno
* Q=AB'+B'C
* C'
* C
* A'B'
* A'B
* AB
* C
* AB
* Bool
* 0
* 0
* 0
* 0
* 0
* 0
* 1
* 0
* 1
* 0
* 0
* 1
* 1
* 1
* 1
* 0
* 1
* 1
* 1
* 1
* 0
* 0
* 1
* 0
* 1
* 1
* 0
* 0
* 0
* 0
* 1
* 1
* AB'
* A
* B
* Q
* Mantık kapı tasarımı
* AB'
* B'C
* Vçık
* C
* Q=AB'+B'C
* A B C Q
* ----------
* 0  0  0  1
* 0  0  1  0
* 0  1  0  1
* 0  1  1  0
* 1  0  0  1
* 1  0  1  0
* 1  1  0  1
* 1  1  1  0
* Doğruluk
* Karno
* C'
* C
* A'B'
* A'B
* AB
* AB
* 0
* 0
* 1
* 1
* AB'
* C
* 1
* 0
* Bool
* Q=C'
* 1
* 0
* Vçık
* C
* A B C Q
* ----------
* 0  0  0  1
* 0  0  1  1
* 0  1  0  0
* 0  1  1  0
* 1  0  0  1
* 1  0  1  1
* 1  1  0  0
* 1  1  1  0
* Doğruluk
* Karno
* C'
* C
* A'B'
* A'B
* AB
* AB
* 0
* 0
* 1
* 1
* AB'
* C
* 1
* Bool
* Q=B'
* 1
* 0
* Vçık
* B
* 0
* C'D'
* C'D
* A'B'
* A'B
* AB
* CD
* A'B'C'D'
* A'B'C'D
* A'BC'D'
* A'BC'D
* Giriş değişkenlerinin yerleşimi
* AB
* AB'
* ABC'D'
* ABC'D
* AB'C'D'
* AB'C'D
* CD
* CD'
* A'B'CD
* A'B'CD'
* A'BCD
* A'BCD'
* ABCD
* ABCD'
* AB'CD
* AB'CD'
* 0000
* 0001
* 0100
* 0101
* 1100
* 1101
* 1000
* 1001
* 0011
* 0010
* 0111
* 0110
* 1111
* 1110
* 1011
* 1010
* A B C D   Q
* -------------
* 0  0  0  0  0
* 0  0  0  1  0
* 0  0  1  0  1
* 0  0  1  1  1
* 0  1  0  0  0
* 0  1  0  1  0
* 0  1  1  0  1
* 0  1  1  1  1
* 1  0  0  0  1
* 1  0  0  1  1
* 1  0  1  0  0
* 1  0  1  1  0
* 1  1  0  0  1
* 1  1  0  1  1
* 1  1  1  0  0
* 1  1  1  1  0
* Doğruluk
* C'D'
* C'D
* A'B'
* A'B
* AB
* CD
* AB
* AB'
* CD
* CD'
* Karno
* 0
* 0
* 1
* 1
* 0
* 0
* 1
* 1
* 1
* 1
* 0
* 0
* 1
* 1
* 0
* 0
* Bool
* Q=AC'+A'C
* Bool
* Q=B'
* Vçık
* C
* Q
* AC'
* A'C
* A
* A B C D   Q
* -------------
* 0  0  0  0  1
* 0  0  0  1  1
* 0  0  1  0  0
* 0  0  1  1  0
* 0  1  0  0  1
* 0  1  0  1  1
* 0  1  1  0  0
* 0  1  1  1  0
* 1  0  0  0  0
* 1  0  0  1  0
* 1  0  1  0  1
* 1  0  1  1  1
* 1  1  0  0  0
* 1  1  0  1  0
* 1  1  1  0  1
* 1  1  1  1  1
* Doğruluk
* C'D'
* C'D
* A'B'
* A'B
* AB
* CD
* AB
* AB'
* CD
* CD'
* Karno
* 1
* Bool
* Q=A'C'+AC
* Vçık
* C
* Q
* AC
* A'C'
* A
* 1
* 1
* 1
* 1
* 1
* 1
* 1
.backanno
.end